# Altium schematic sheet design_19.SchDoc: design
size 414 x 279 mm; Date: 1/25/2021 11:39:22 PM; SheetNumber: 20; Origin: Eagle; GateName_1: G$1; SymbolName_1: A3-L-GUMSTIX; LibraryName: qualified_1; DeviceSetName: A3-L-GUMSTIX; A: A; B: B; C: C; D: D; E: E; F: F; G: G; H: H; 1: 1; 2: 2; 3: 3; 4: 4; 5: 5; Sheet: Sheet:; C:/Gumstix/gumstix-logo-16.bmp: C:/Gumstix/gumstix-logo-16.bmp; Board: Board:
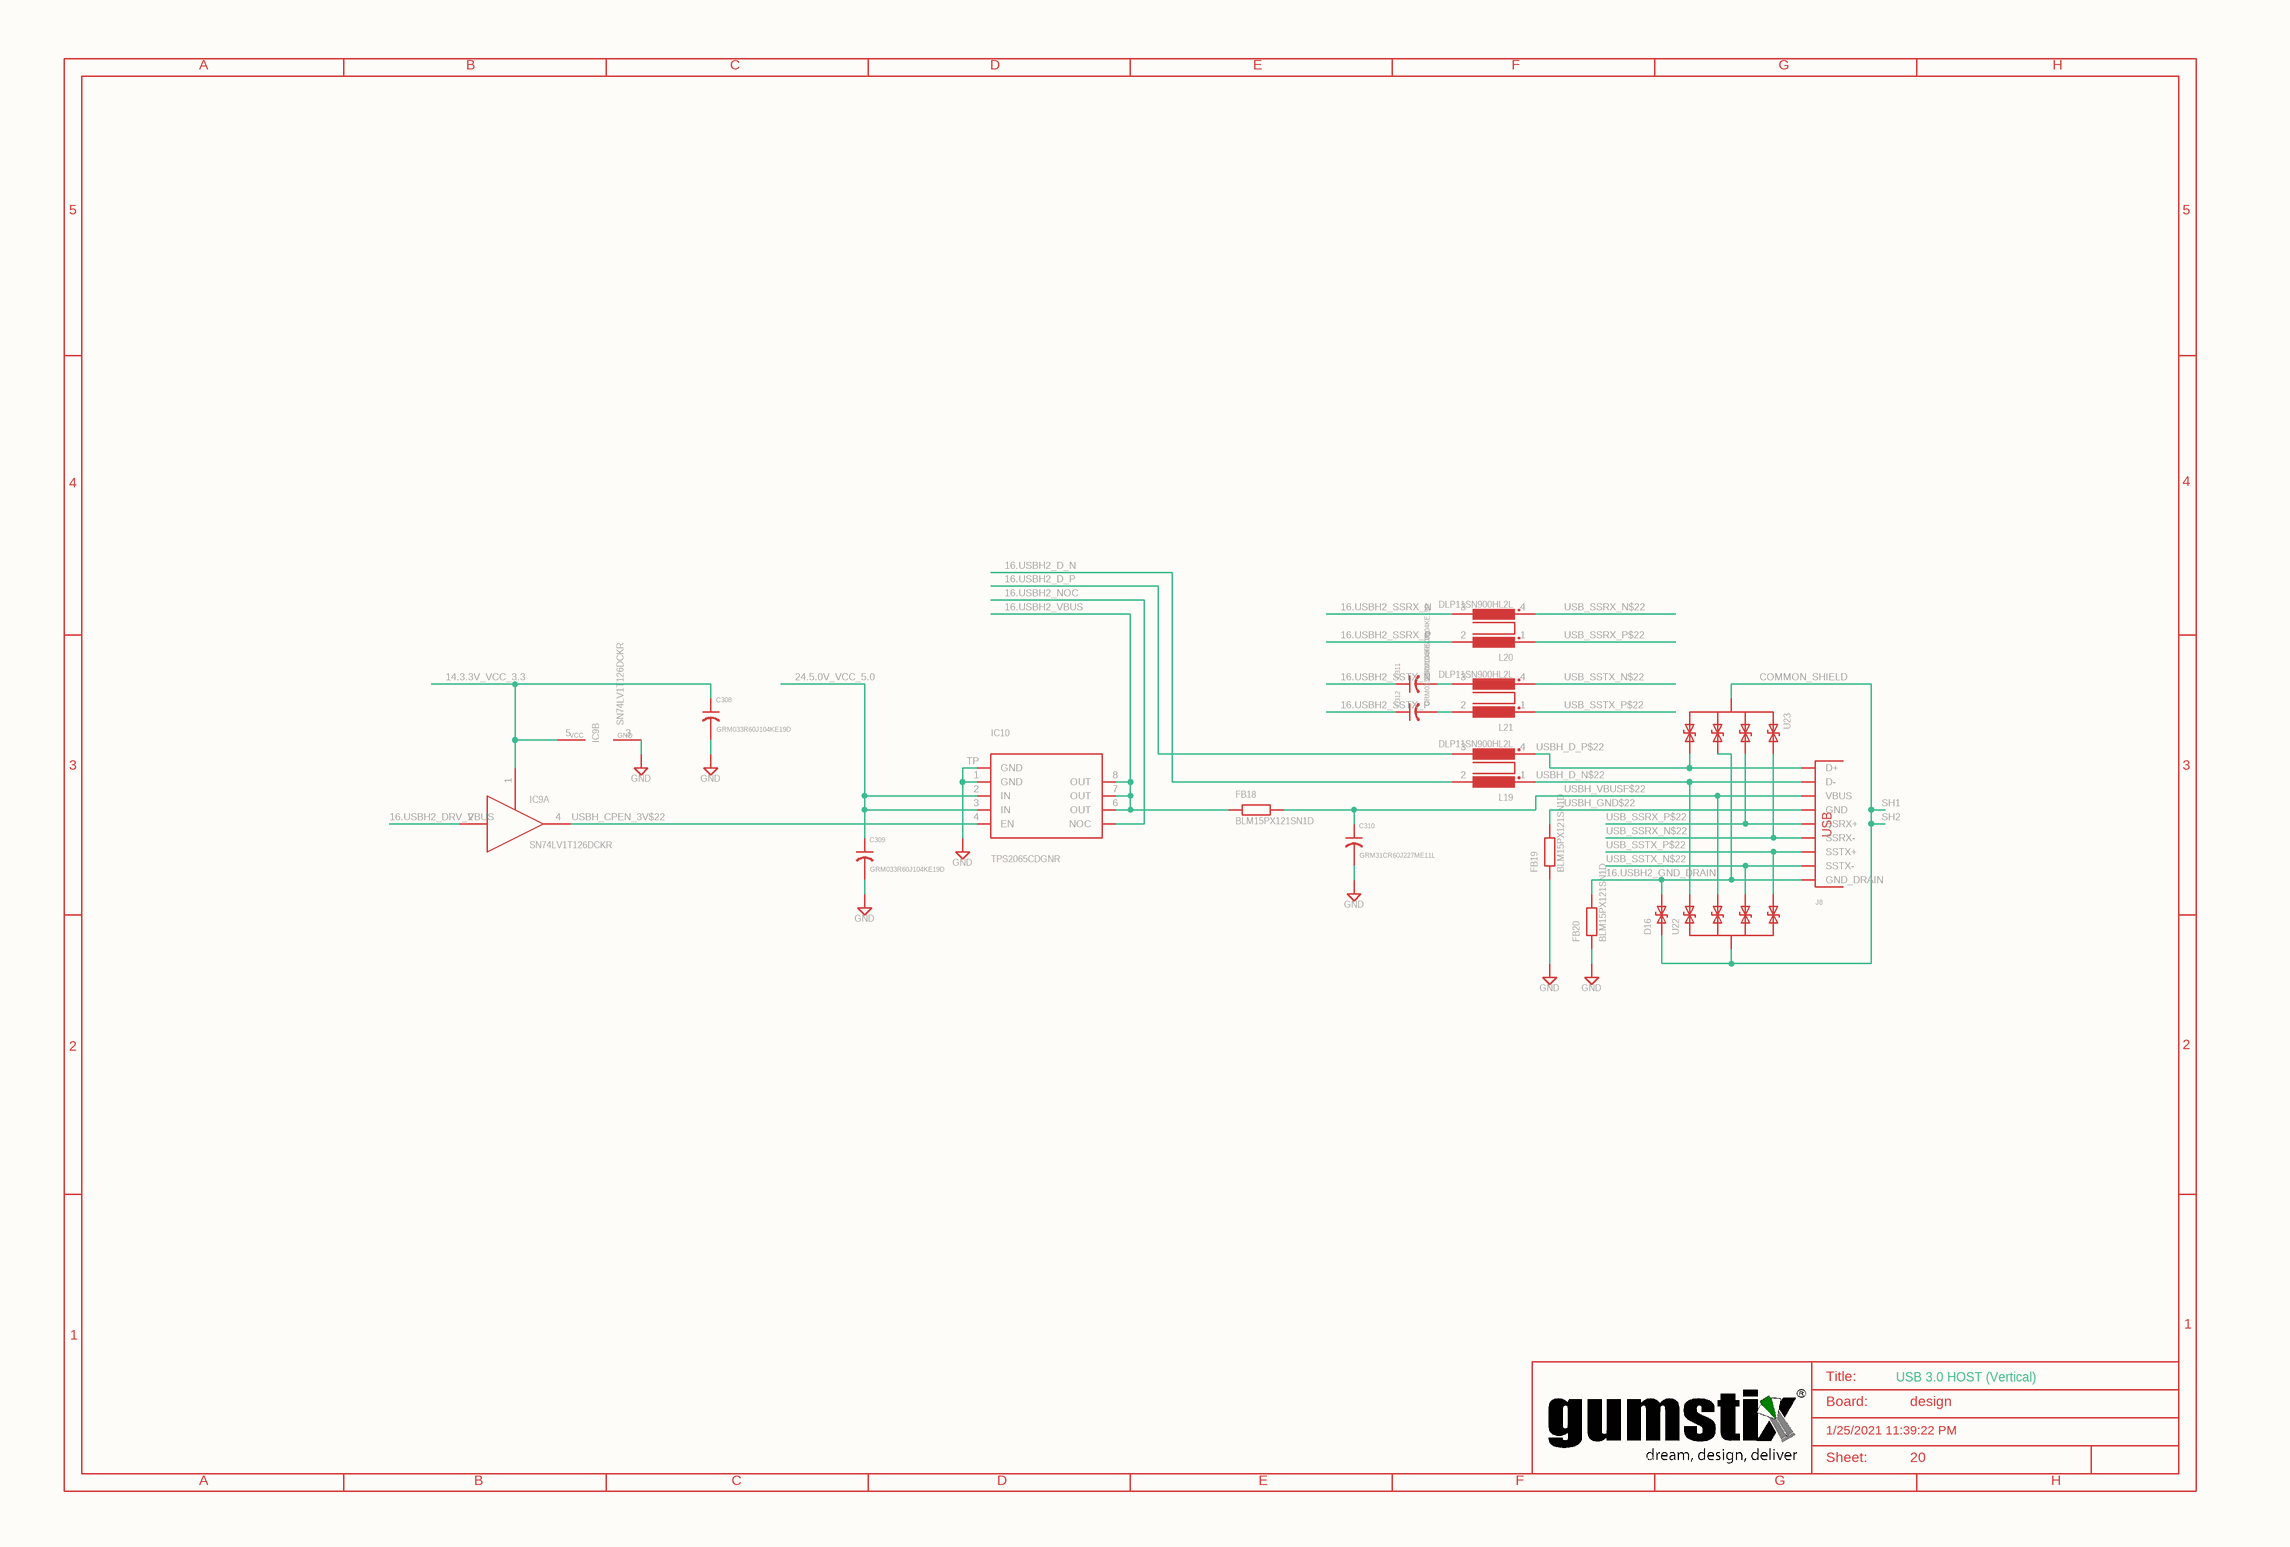
[diagram p0: design_19.SchDoc]

## Parts
C308  GRM033R60J104KE19D  [0201]
C309  GRM033R60J104KE19D  [0201]
C310  GRM31CR60J227ME11L  [1206]
C311  GRM033R60J104KE19D  [0201]
C312  GRM033R60J104KE19D  [0201]
D16  PS04LTVA1  [D0402]  (value not drawn)
FB18  BLM15PX121SN1D  [0402]
FB19  BLM15PX121SN1D  [0402]
FB20  BLM15PX121SN1D  [0402]
IC9  SN74LV1T126DCKR  [SC70-5]  (parts A,B of 2)
IC10  TPS2065CDGNR  [MSOP8-PAD]
J8  10117836-002LF  [USB3-A-H-VERT]  (value not drawn)
L19  DLP11SN900HL2L  [0504-DLP11S]
L20  DLP11SN900HL2L  [0504-DLP11S]
L21  DLP11SN900HL2L  [0504-DLP11S]
SUPPLY180  GND
SUPPLY181  GND
SUPPLY182  GND
SUPPLY183  GND
SUPPLY184  GND
SUPPLY185  GND
SUPPLY186  GND
U22  TPD4E02B04DQAR  [UFDFN-10]  (value not drawn)
U23  TPD4E02B04DQAR  [UFDFN-10]  (value not drawn)

## Nets
14.3.3V_VCC_3.3: C308.1 IC9.1(OE) IC9.5(VCC)
16.USBH2_D_N: L19.2
16.USBH2_D_P: L19.3
16.USBH2_DRV_VBUS: IC9.2(I)
16.USBH2_GND_DRAIN: D16.P2 FB20.2 J8.DRAIN(GND_DRAIN) U23.4_7(P3)
16.USBH2_NOC: IC10.5(NOC)
16.USBH2_SSRX_N: L20.3
16.USBH2_SSRX_P: L20.2
16.USBH2_SSTX_N: C311.1
16.USBH2_SSTX_P: C312.1
16.USBH2_VBUS: FB18.1 IC10.6(OUT) IC10.7(OUT) IC10.8(OUT)
24.5.0V_VCC_5.0: C309.1 IC10.2(IN) IC10.3(IN)
COMMON_SHIELD: D16.P1 J8.SH1 J8.SH2 U22.3_8(SHIELD) U23.3_8(SHIELD)
USB_SSRX_N$22: J8.SSRX- L20.4 U23.1_10(P1)
USB_SSRX_P$22: J8.SSRX+ L20.1 U23.2_9(P2)
USB_SSTX_N$22: J8.SSTX- L21.4 U22.4_7(P3)
USB_SSTX_P$22: J8.SSTX+ L21.1 U22.5_6(P4)
USBH_CPEN_3V$22: IC9.4(O) IC10.4(EN)
USBH_D_N$22: J8.D- L19.1 U22.1_10(P1)
USBH_D_P$22: J8.D+ L19.4 U23.5_6(P4)
USBH_GND$22: FB19.2 J8.GND
USBH_VBUSF$22: C310.1 FB18.2 J8.VBUS U22.2_9(P2)
NetC308_2: C308.2 SUPPLY184.?1(GND)
NetC309_2: C309.2 SUPPLY181.?1(GND)
NetC310_2: C310.2 SUPPLY185.?1(GND)
NetC311_2: C311.2 L21.3
NetC312_2: C312.2 L21.2
NetFB19_1: FB19.1 SUPPLY180.?1(GND)
NetFB20_1: FB20.1 SUPPLY186.?1(GND)
NetIC9_3: IC9.3(GND) SUPPLY183.?1(GND)
NetIC10_1: IC10.1(GND) IC10.TP(GND) SUPPLY182.?1(GND)

## Notes on the sheet
- A
- B
- C
- D
- E
- F
- G
- H
- 5
- 4
- 3
- 2
- 1
- Title:
- Board:
- USB 3.0 HOST (Vertical)
- design
- C:/Gumstix/gumstix-logo-16.bmp
- 1/25/2021 11:39:22 PM
- Sheet:
- 20

## Library data of the parts
C308 C309 C311 C312 = GRM033R60J104KE19D: GateName_1: G$1; SymbolName_1: C-US; LibraryName: qualified_1@eagle_src_repo_0b5741b5d4abbb92614c593c71c49b300549e5ff; DeviceSetName: GRM033R60J104KE19D; HEIGHT: 0.25
  C309: DM: DM; DR: DR; DX: DX; DY: DY; SHEETNO: SHEETNO
C310 = GRM31CR60J227ME11L: GateName_1: G$1; SymbolName_1: C-US; LibraryName: qualified_1@eagle_src_repo_0b5741b5d4abbb92614c593c71c49b300549e5ff; DeviceSetName: GRM31CR60J227ME11L; DM: DM; DR: DR; DX: DX; DY: DY; HEIGHT: 0.51; SHEETNO: SHEETNO
D16 = PS04LTVA1: GateName_1: G$1; SymbolName_1: ESD-DIODE; LibraryName: qualified_1; DeviceSetName: PS04LTVA1; HEIGHT: 0.35
FB18-FB20 = BLM15PX121SN1D: GateName_1: G$1; SymbolName_1: FB; LibraryName: qualified_1@eagle_src_repo_0b5741b5d4abbb92614c593c71c49b300549e5ff; DeviceSetName: BLM15PX121SN1D; DM: DM; DR: DR; DX: DX; DY: DY; HEIGHT: 0.35; SHEETNO: SHEETNO
IC9 = SN74LV1T126DCKR: Single Bus Buffer Gate With 3-State Outputs; GateName_1: A; SymbolName_1: 74126; GateName_2: P; SymbolName_2: PWRN; LibraryName: qualified_1; DeviceSetName: SN74LV1T126DCKR; HEIGHT: 1.1
IC10 = TPS2065CDGNR: GateName_1: G$1; SymbolName_1: TPS2051; LibraryName: qualified_1; DeviceSetName: TPS2065CDGNR; HEIGHT: 1.1
J8 = 10117836-002LF: USB 3.0 Host A; GateName_1: G$1; SymbolName_1: USB3-H; LibraryName: qualified_1; DeviceSetName: 10117836-002LF; USB: USB
L19-L21 = DLP11SN900HL2L: GateName_1: G$1; SymbolName_1: COM_MODE_CHOKE_DLP; LibraryName: qualified_1@eagle_src_repo_0b5741b5d4abbb92614c593c71c49b300549e5ff; DeviceSetName: DLP11SN900HL2L; HEIGHT: 0.83
SUPPLY180-SUPPLY186 = GND: SUPPLY SYMBOL; SymbolName_1: GND-2; GateName_1: GND; LibraryName: qualified_1; DeviceSetName: GND
U22 U23 = TPD4E02B04DQAR: TPD4E02B04 4-Channel ESD Protection Diode for USB Type-C and HDMI 2.0    http://www.ti.com/lit/ds/symlink/tpd4e02b04.pdf; GateName_1: G1; SymbolName_1: ESD-DIODE-4; LibraryName: qualified_1; DeviceSetName: TPD4E02B04DQAR